# Altium project bbb.PrjPcb
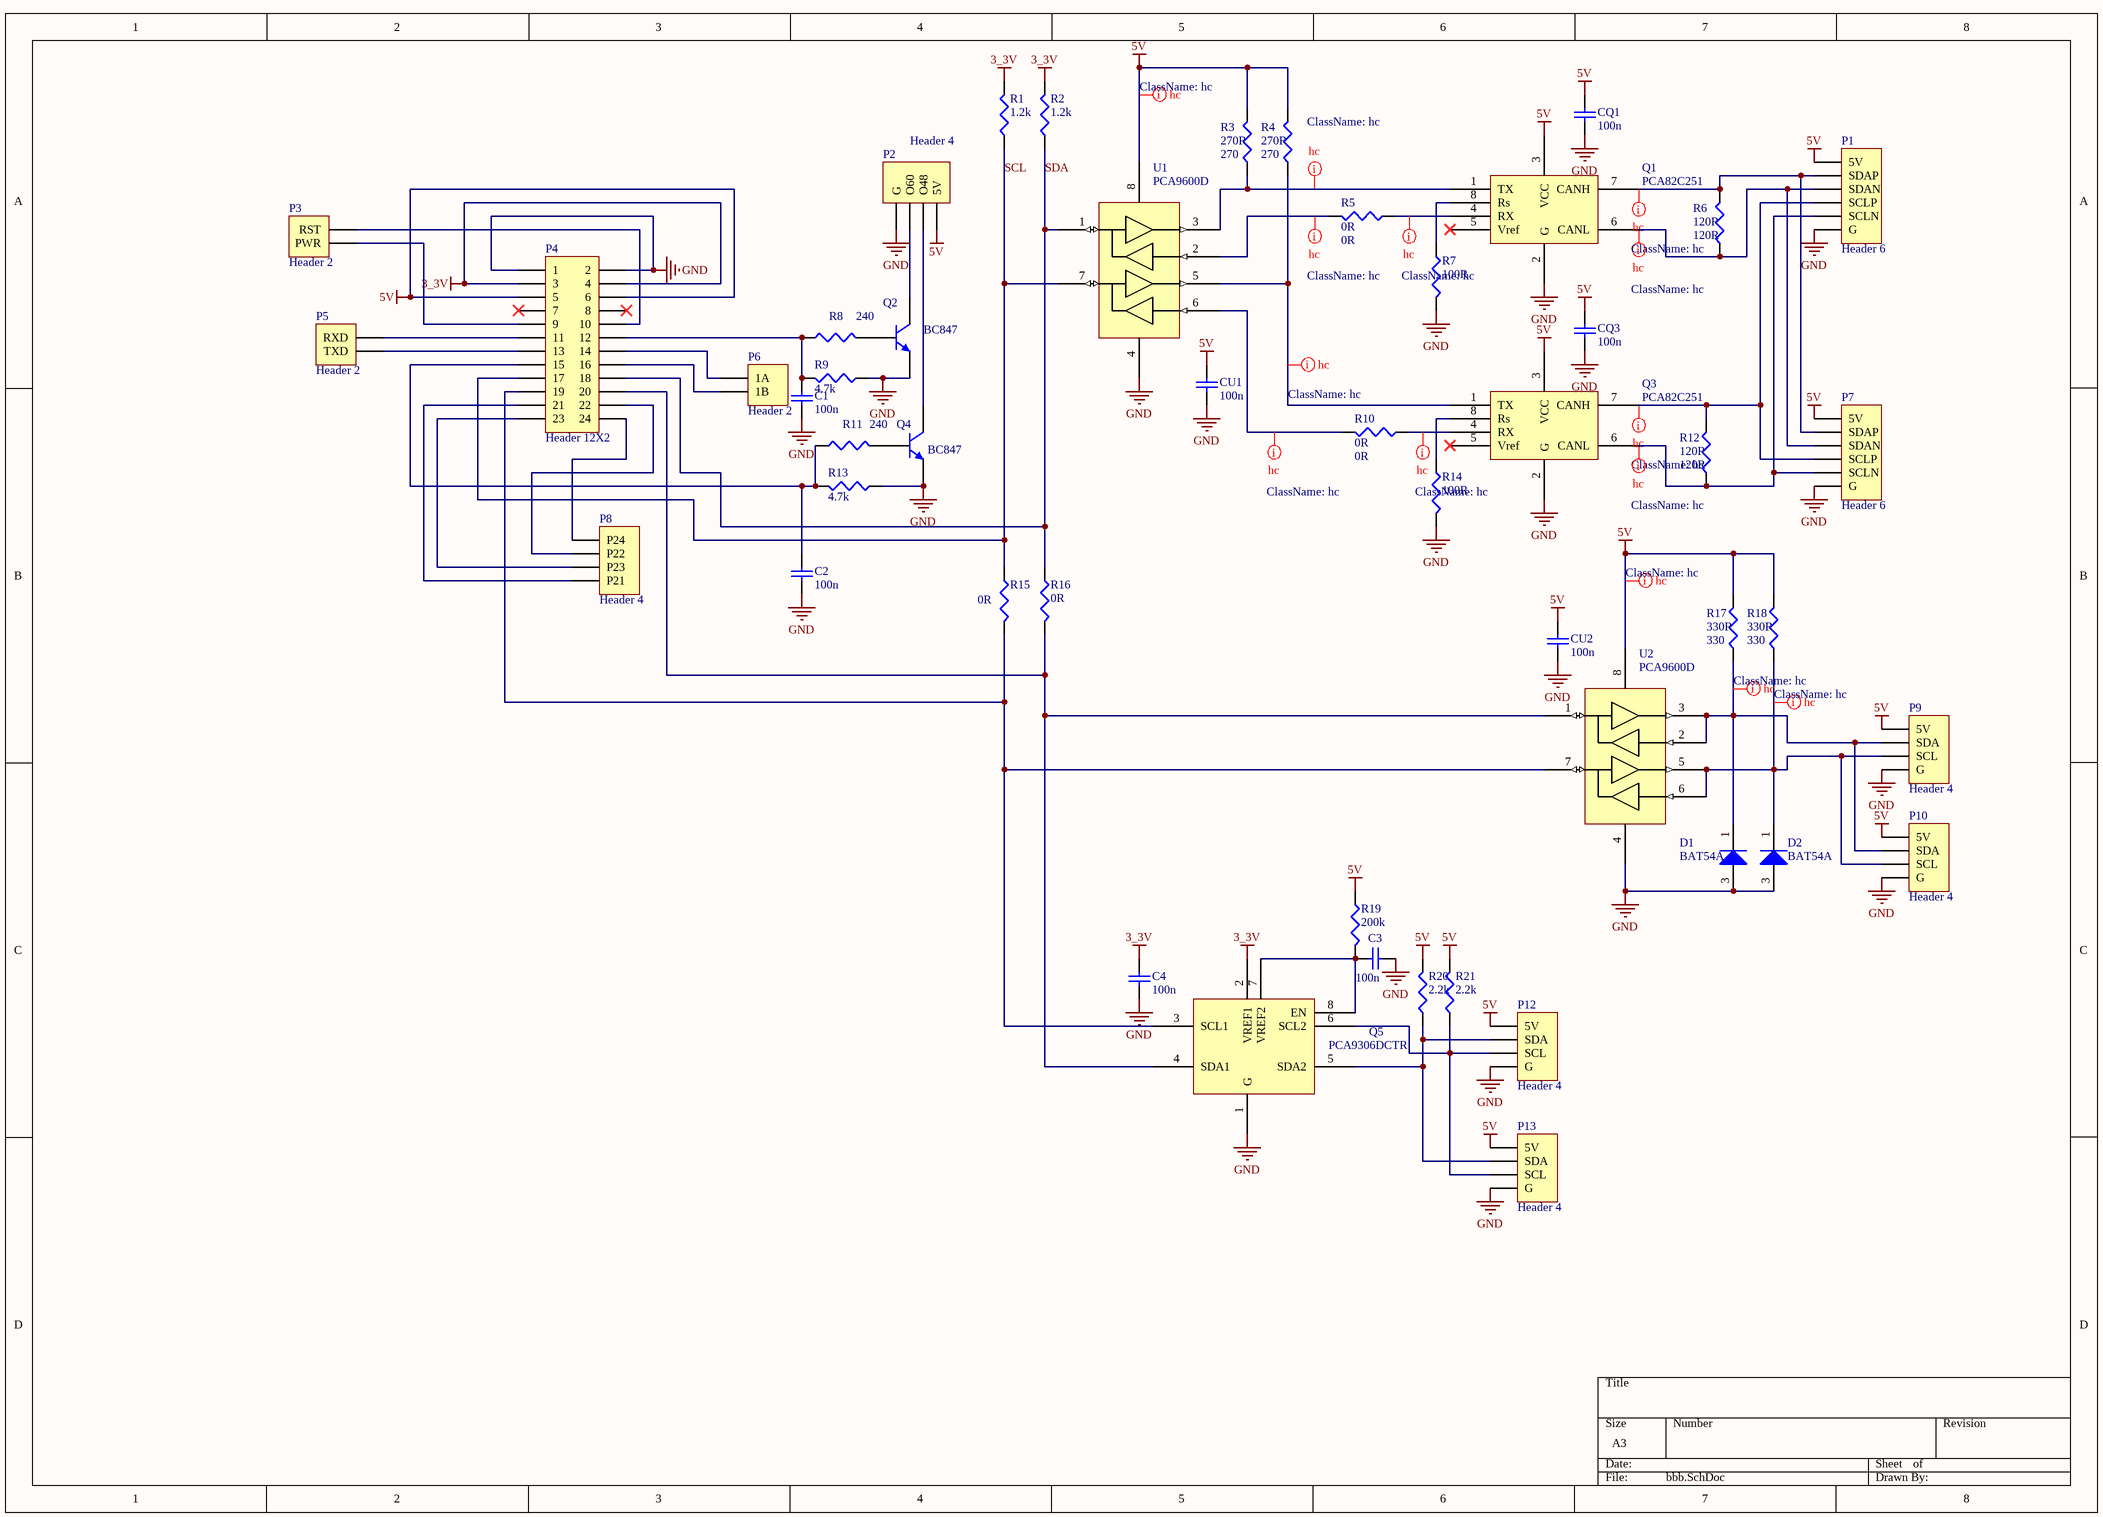
[diagram p0: bbb.SchDoc]
1 sheet, 50 parts. Net scope: global (net labels, ports and power ports of the same name join across sheets).
Board file: bbb.PcbDoc

## Sheet bbb.SchDoc
size A3

### Parts
C1  100n  [1608[0603]]
C2  100n  [1608[0603]]
C3  100n  [C1206]
C4  100n  [C1206]
CQ1  100n  [C1206]
CQ3  100n  [C1206]
CU1  100n  [C1206]
CU2  100n  [C1206]
D1  BAT54A  [SOT-23_N]
D2  BAT54A  [SOT-23_N]
P1  Header 6  [HDR1X6]
P2  Header 4  [HDR1X4]
P3  Header 2  [HDR1X2]
P4  Header 12X2  [HDR2X12]
P5  Header 2  [HDR1X2]
P6  Header 2  [HDR1X2]
P7  Header 6  [HDR1X6]
P8  Header 4  [HDR1X4]
P9  Header 4  [HDR1X4]
P10  Header 4  [HDR1X4]
P12  Header 4  [HDR1X4]
P13  Header 4  [HDR1X4]
Q1  PCA82C251  [SOIC150-8_M]
Q2  BC847  [SOT-23B_N]
Q3  PCA82C251  [SOIC150-8_M]
Q4  BC847  [SOT-23B_N]
Q5  PCA9306DCTR  [DCT]
R1  1.2k  [J1-0603]
R2  1.2k  [J1-0603]
R3  270R  value 270  [R1206]
R4  270R  value 270  [R1206]
R5  0R  [R1206]
R6  120R  [R1206]
R7  100R  [J1-0603]
R8  value 240  [J1-0603]  (hidden comment: 240R)
R9  4.7k  [J1-0603]
R10  0R  [R1206]
R11  value 240  [J1-0603]  (hidden comment: 240R)
R12  120R  [R1206]
R13  4.7k  [J1-0603]
R14  100R  [J1-0603]
R15  0R  [J1-0603]
R16  0R  [J1-0603]
R17  330R  value 330  [R1206]
R18  330R  value 330  [R1206]
R19  200k  [J1-0603]
R20  2.2k  [J1-0603]
R21  2.2k  [J1-0603]
U1  PCA9600D  [SOIC150-8_M]
U2  PCA9600D  [SOIC150-8_M]

### Nets
3_3V: C4.2 P4.3 P4.4 Q5.2(VREF1) R1.2 R2.2
5V: CQ1.2 CQ3.2 CU1.2 CU2.2 P1.6(5V) P2.4(5V) P4.5 P4.6 P7.6(5V) P9.4(5V) P10.4(5V) P12.4(5V) P13.4(5V) Q1.3(VCC) Q3.3(VCC) R3.2 R4.2 R17.2 R18.2 R19.1 R20.2 R21.2 U1.8 U2.8
GND: C1.2 C2.2 C3.2 C4.1 CQ1.1 CQ3.1 CU1.1 CU2.1 D1.3(A) D2.3(A) P1.1(G) P2.1(G) P4.1 P4.2 P7.1(G) P9.1(G) P10.1(G) P12.1(G) P13.1(G) Q1.2(G) Q2.3(E) Q3.2(G) Q4.3(E) Q5.1(G) R7.2 R9.1 R13.1 R14.2 U1.4 U2.4
SCL: P4.17 R1.1 R15.1 U1.7
SDA: P4.18 R2.1 R16.1 U1.1
NetC1_1: C1.1 P4.12 R8.1 R9.2
NetC2_1: C2.1 P4.15 R11.1 R13.2
NetC3_1: C3.1 Q5.7(VREF2) Q5.8(EN) R19.2
NetD1_1: D1.1(K) P9.3(SDA) P10.3(SDA) R17.1 U2.2 U2.3
NetD2_1: D2.1(K) P9.2(SCL) P10.2(SCL) R18.1 U2.5 U2.6
NetP1_2: P1.2(SCLN) P7.2(SCLN) Q3.6(CANL) R12.1
NetP1_3: P1.3(SCLP) P7.3(SCLP) Q3.7(CANH) R12.2
NetP1_4: P1.4(SDAN) P7.4(SDAN) Q1.6(CANL) R6.1
NetP1_5: P1.5(SDAP) P7.5(SDAP) Q1.7(CANH) R6.2
NetP2_2: P2.2(O60) Q2.1(C)
NetP2_3: P2.3(O48) Q4.1(C)
NetP3_1: P3.1(PWR) P4.9
NetP3_2: P3.2(RST) P4.10
NetP4_11: P4.11 P5.2(RXD)
NetP4_13: P4.13 P5.1(TXD)
NetP4_14: P4.14 P6.1(1A)
NetP4_16: P4.16 P6.2(1B)
NetP4_19: P4.19 Q5.3(SCL1) R15.2 U2.7
NetP4_20: P4.20 Q5.4(SDA1) R16.2 U2.1
NetP4_21: P4.21 P8.1(P21)
NetP4_22: P4.22 P8.3(P22)
NetP4_23: P4.23 P8.2(P23)
NetP4_24: P4.24 P8.4(P24)
NetP12_2: P12.2(SCL) P13.2(SCL) Q5.6(SCL2) R21.1
NetP12_3: P12.3(SDA) P13.3(SDA) Q5.5(SDA2) R20.1
NetQ1_1: Q1.1(TX) R3.1 U1.3
NetQ1_4: Q1.4(RX) R5.1
NetQ1_8: Q1.8(Rs) R7.1
NetQ2_2: Q2.2(B) R8.2
NetQ3_1: Q3.1(TX) R4.1 U1.5
NetQ3_4: Q3.4(RX) R10.1
NetQ3_8: Q3.8(Rs) R14.1
NetQ4_2: Q4.2(B) R11.2
NetR5_2: R5.2 U1.2
NetR10_2: R10.2 U1.6

Not connected (* = marked no-connect by the designer): P4 7* 8*; Q1 5(Vref)*; Q3 5(Vref)*

### Layout directives
net class hc: 5V, NetD1_1, NetD2_1, NetP1_2, NetP1_3, NetP1_4, NetP1_5, NetQ1_1, NetQ1_4, NetQ3_1, NetQ3_4, NetR5_2, NetR10_2

### Library data of the parts
C1-C4 CQ1 CQ3 CU1 CU2 = Cap Semi: Capacitor (Semiconductor SIM Model); Published: 8-Jun-2000; LatestRevisionDate: 29-May-2009; LatestRevisionNote: IPC-7351 Footprint Added.; PackageReference: C1206; Publisher: Altium Limited; PackageDescription: Chip Capacitor; Value: 100n
D1 D2 = Diode: Default Diode; Published: 8-Jun-2000; LatestRevisionDate: 17-Jul-2002; LatestRevisionNote: Re-released for DXP Platform.; PackageVersion: Sep-1996; PackageReference: SMC; Publisher: Altium Limited; PackageDescription: DO-214-AB/SMC; 2 C-Bend Leads; Body 7.9 x 5.9 mm, inc. leads (LxW); Code_JEDEC: DO-214-AB
P1 P7 = Header 6: Header, 6-Pin; LatestRevisionDate: 17-Jul-2002; LatestRevisionNote: Re-released for DXP Platform.; Publisher: Altium Limited
P2 P8-P10 P12 P13 = Header 4: Header, 4-Pin; LatestRevisionDate: 17-Jul-2002; LatestRevisionNote: Re-released for DXP Platform.; Publisher: Altium Limited
P3 P5 P6 = Header 2: Header, 2-Pin; LatestRevisionDate: 17-Jul-2002; LatestRevisionNote: Re-released for DXP Platform.; Publisher: Altium Limited
P4 = Header 12X2: Header, 12-Pin, Dual row; LatestRevisionDate: 17-Jul-2002; LatestRevisionNote: Re-released for DXP Platform.; Publisher: Altium Limited
Q2 Q4 = QNPN: NPN Bipolar Transistor; Published: 8-Jun-2000; LatestRevisionDate: 29-May-2009; LatestRevisionNote: IPC-7351 Footprint Added.; PackageVersion: Aug-1999; PackageReference: SOT-23B; Publisher: Altium Limited; PackageDescription: 3-Pin SOT-23 Package 0.95 mm Pitch, 2.4 mm Lead Span
Q5 = PCA9306
R1-R21 = Res3: Resistor; Published: 8-Jun-2000; LatestRevisionDate: 29-May-2009; LatestRevisionNote: IPC-7351 Footprint Added.; PackageReference: J1-0603; Publisher: Altium Limited; PackageDescription: Chip Resistor
  R1 R2: Value: 1.2k
  R5 R10 R15 R16: Value: 0R
  R6 R12: Value: 120R
  R7 R14: Value: 100R
  R9 R13: Value: 4.7k
  R19: Value: 200k
  R20 R21: Value: 2.2k
U1 U2 = P82B96